# EAGLE schematic Arduino-DUE-V03-Rocket (EAGLE 8.6.0)
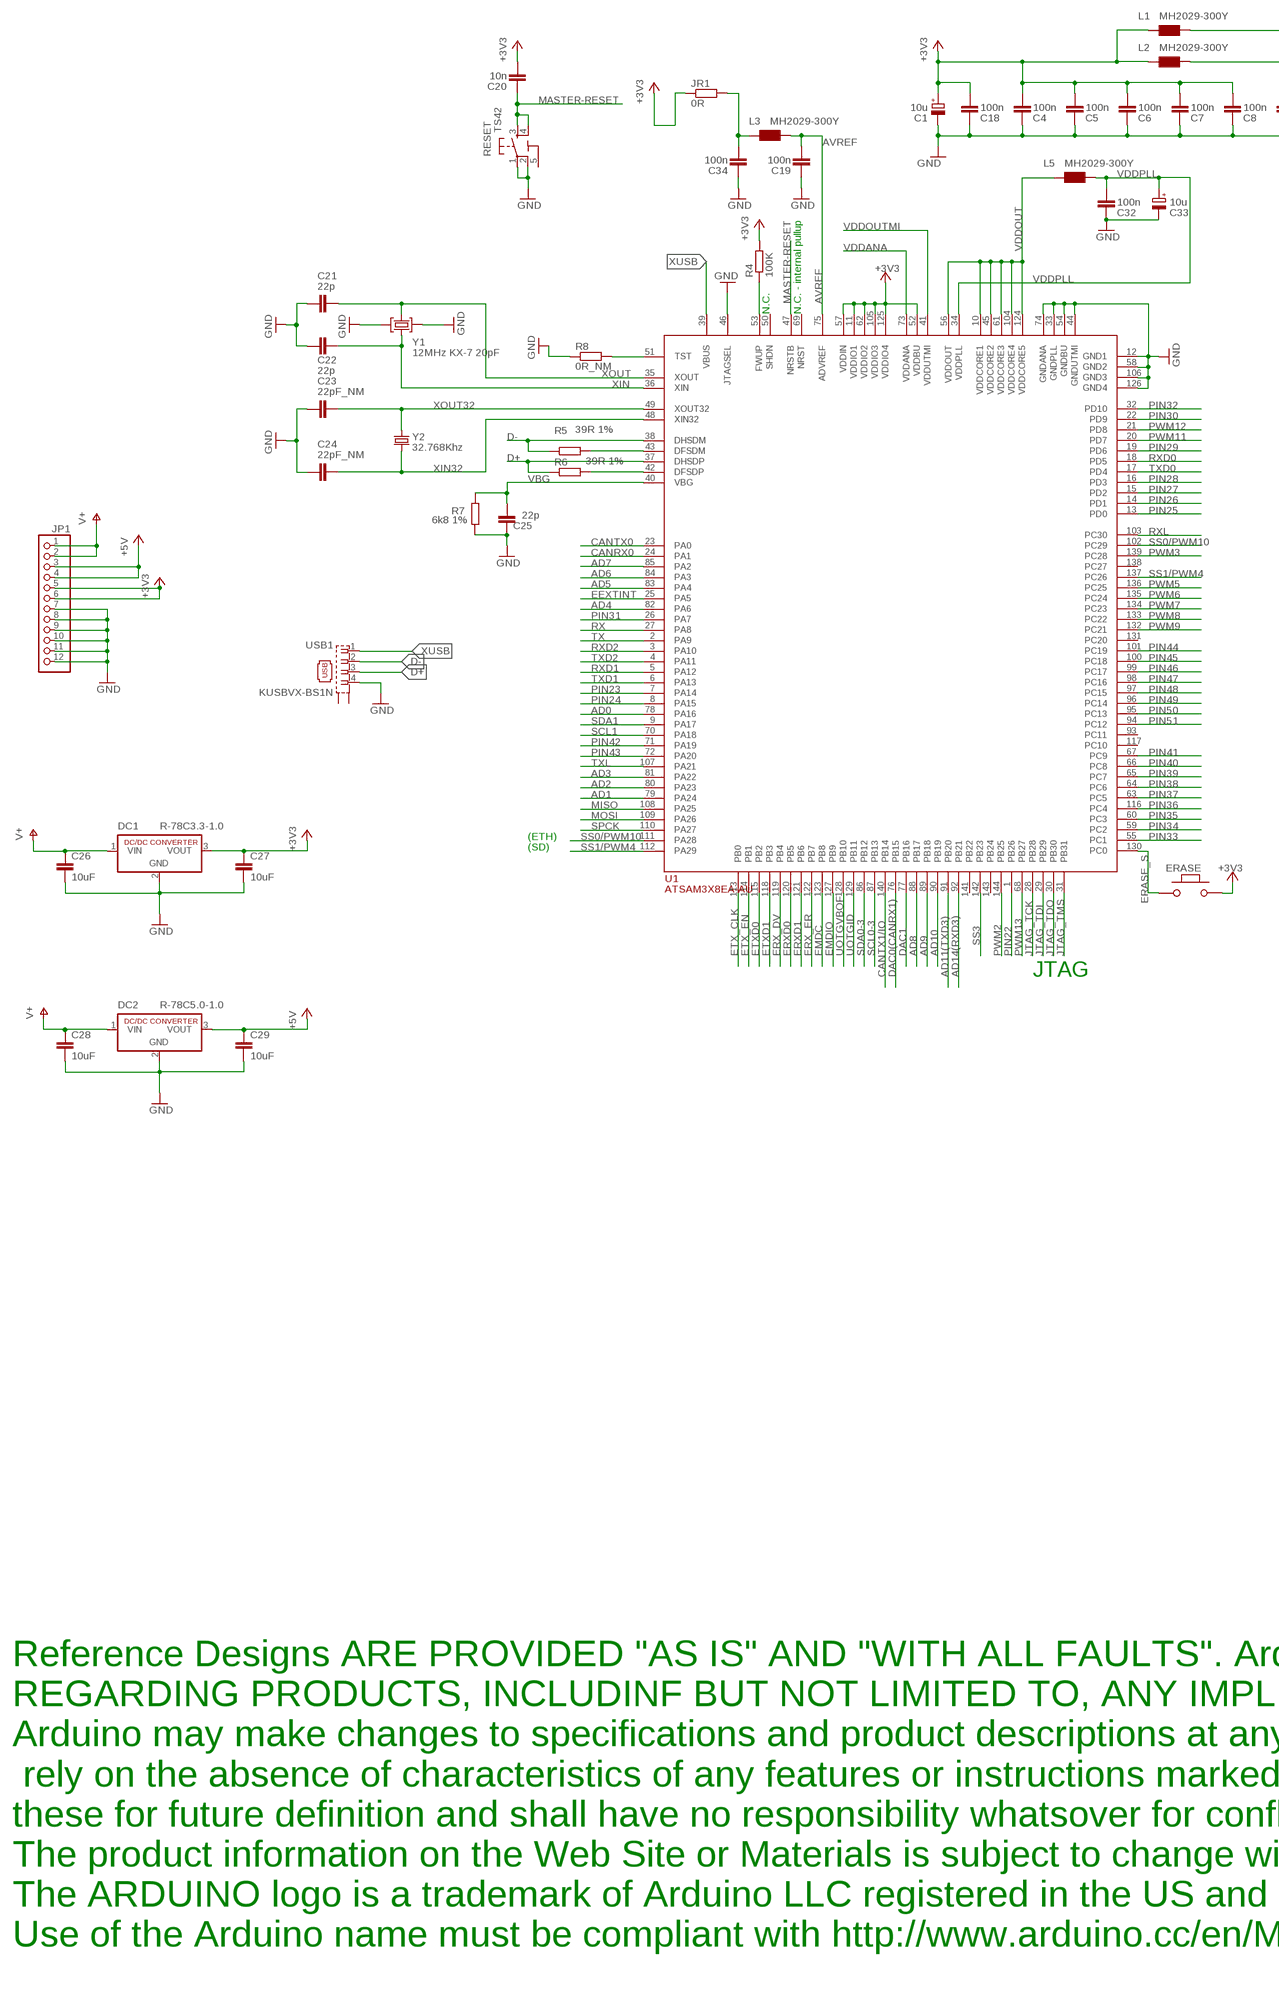
[diagram p0: schematic, sheet 1, part 1 of 2]
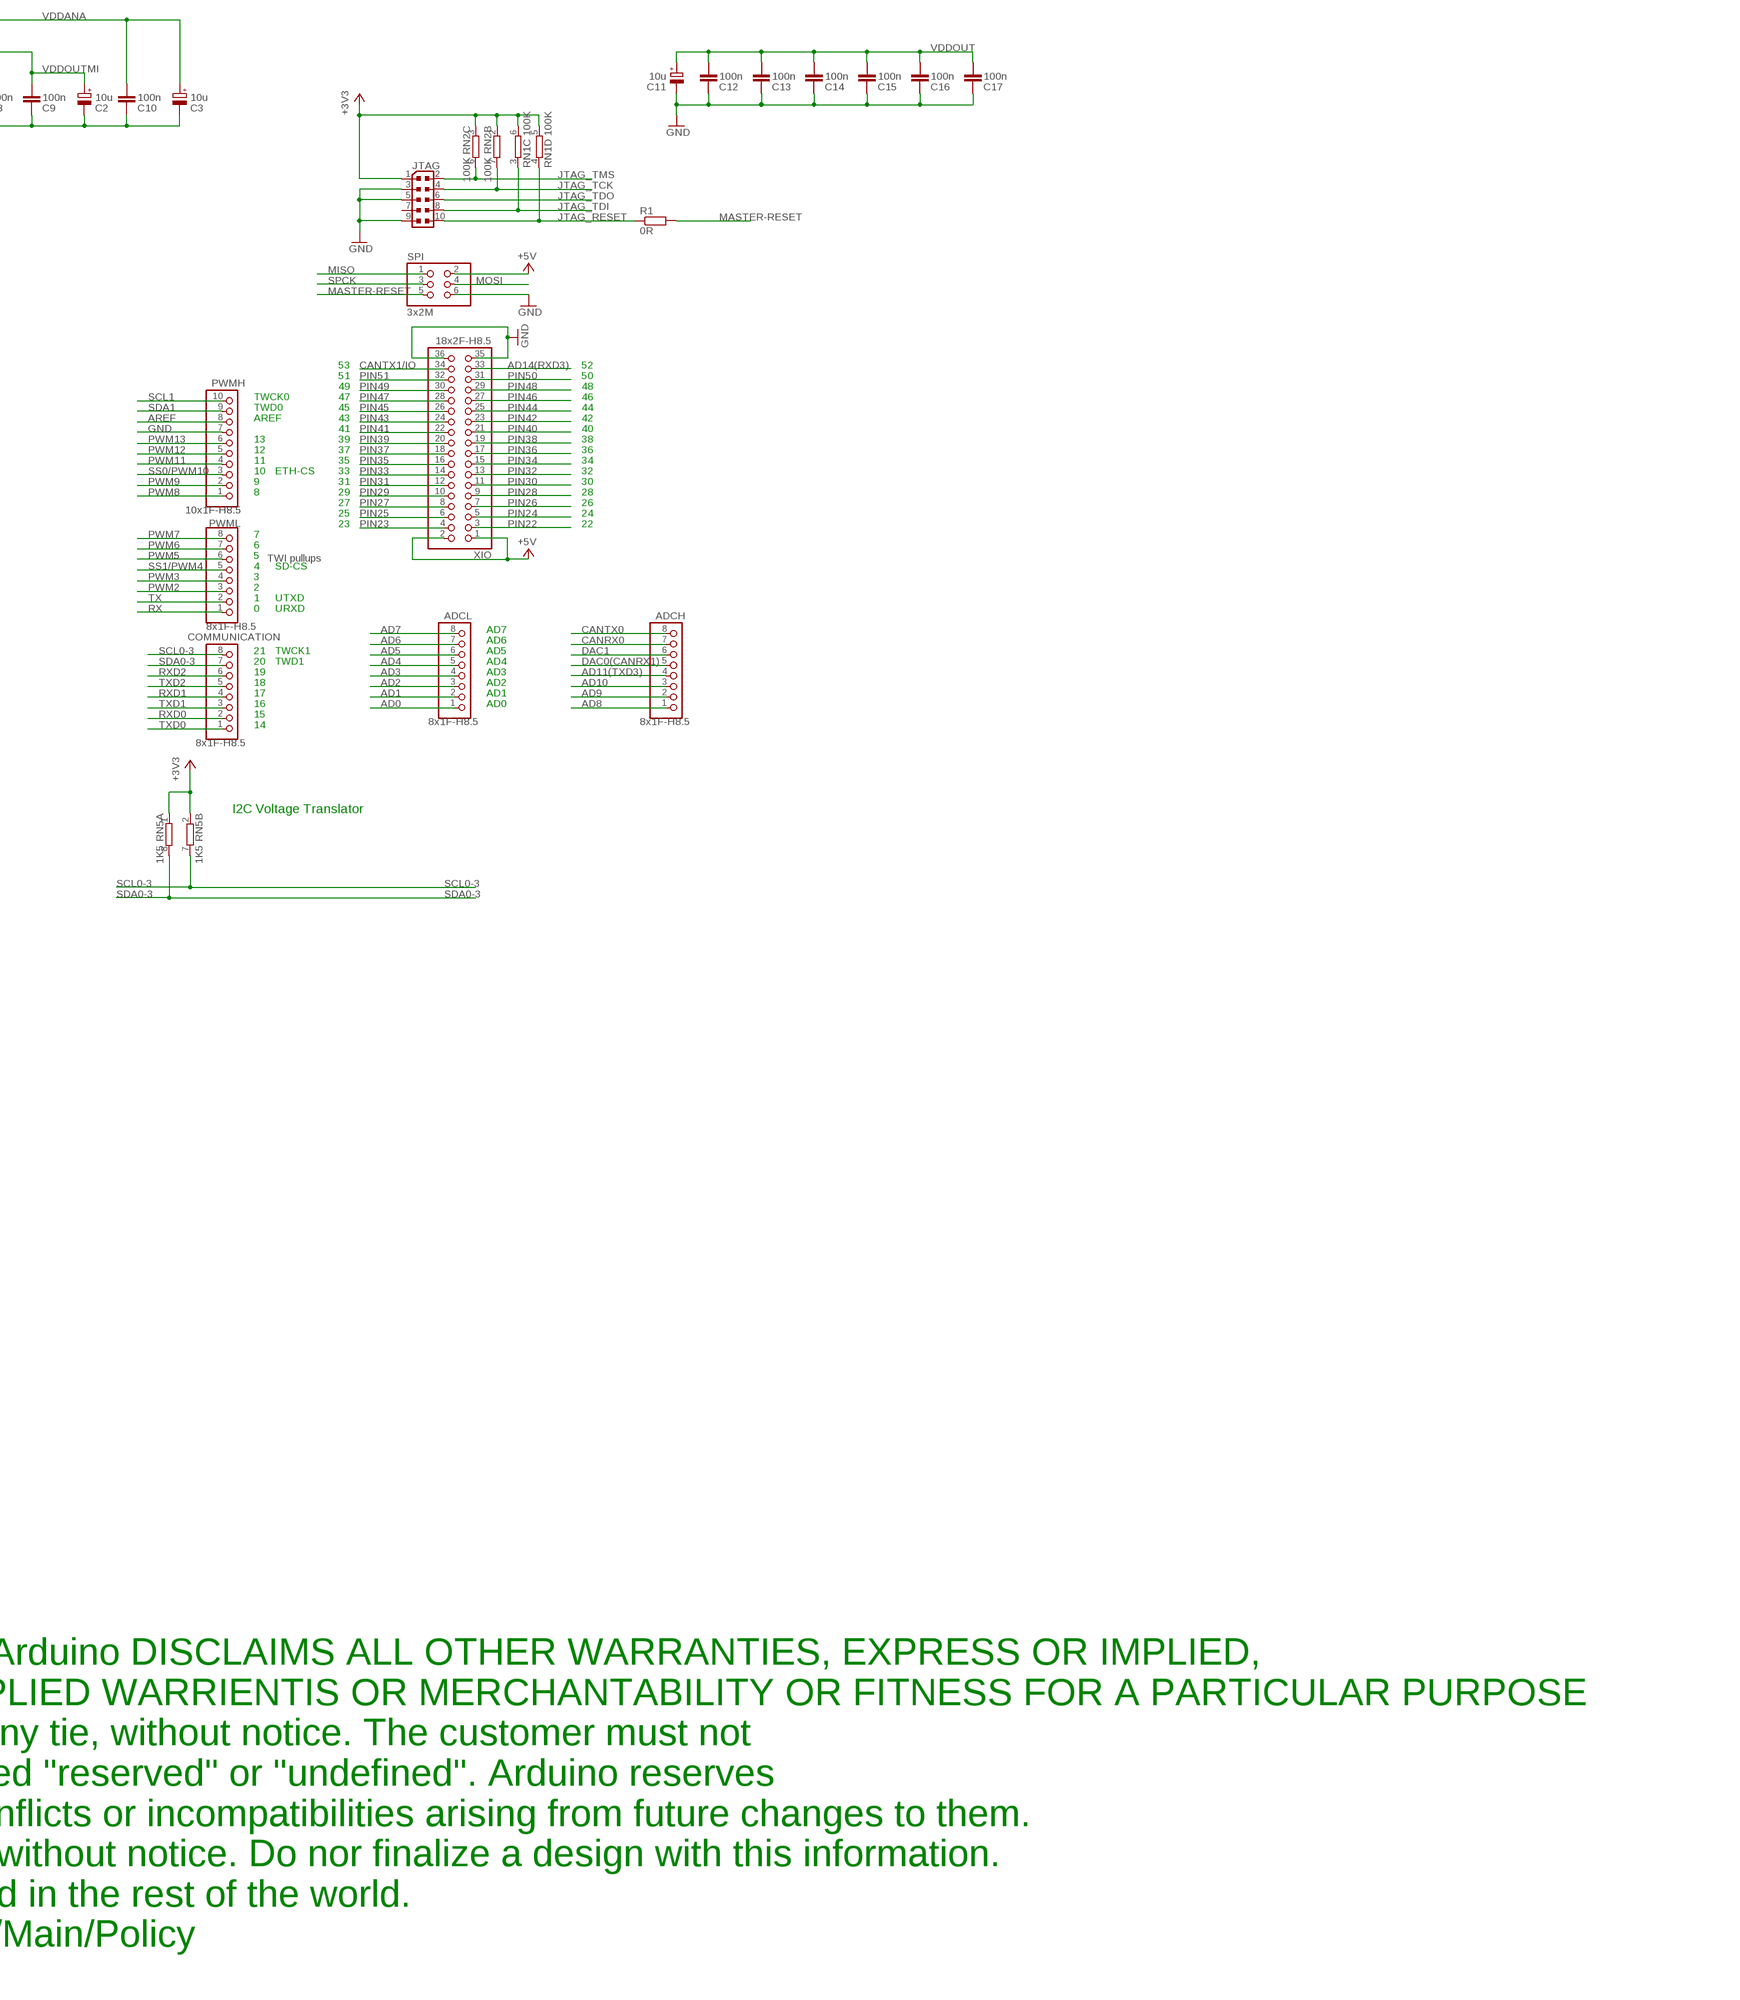
[diagram p1: schematic, sheet 1, part 2 of 2]

## Parts
ADCH  8x1F-H8.5  PINHD-1X8  [1X08]
ADCL  8x1F-H8.5  PINHD-1X8  [1X08]
C1  10u  CPOL-EUSMCB  [SMC_B]
C2  10u  CPOL-EUSMCB  [SMC_B]
C3  10u  CPOL-EUSMCB  [SMC_B]
C4  100n  C-EUC0402  [C0402]
C5  100n  C-EUC0402  [C0402]
C6  100n  C-EUC0402  [C0402]
C7  100n  C-EUC0402  [C0402]
C8  100n  C-EUC0402  [C0402]
C9  100n  C-EUC0402  [C0402]
C10  100n  C-EUC0402  [C0402]
C11  10u  CPOL-EUSMCB  [SMC_B]
C12  100n  C-EUC0402  [C0402]
C13  100n  C-EUC0402  [C0402]
C14  100n  C-EUC0402  [C0402]
C15  100n  C-EUC0402  [C0402]
C16  100n  C-EUC0402  [C0402]
C17  100n  C-EUC0402  [C0402]
C18  100n  C-EUC0402  [C0402]
C19  100n  C-EUC0402  [C0402]
C20  10n  C-EUC0402  [C0402]
C21  22p  C-EUC0402  [C0402]
C22  22p  C-EUC0402  [C0402]
C23  22pF_NM  C-EUC0402  [C0402]
C24  22pF_NM  C-EUC0402  [C0402]
C25  22p  C-EUC0402  [C0402]
C26  10uF  C-EU050-030X075  [C050-030X075]
C27  10uF  C-EU050-030X075  [C050-030X075]
C28  10uF  C-EU050-030X075  [C050-030X075]
C29  10uF  C-EU050-030X075  [C050-030X075]
C32  100n  C-EUC0402  [C0402]
C33  10u  CPOL-EUSMCB  [SMC_B]
C34  100n  C-EUC0402  [C0402]
COMMUNICATION  8x1F-H8.5  PINHD-1X8  [1X08]
DC1  R-78C3.3-1.0  [SIP3]
DC2  R-78C5.0-1.0  [SIP3]
ERASE  MYSMD_PB157  [SMD_157SW]
JP1  PINHD-1X12  [1X12]
JR1  0R  R-EU_R0402  [R0402]
JTAG  PINHEAD_PINHD-2X5PASSO127  [PINHEAD_2X05_127]
L1  MH2029-300Y  WE-CBF_0805  [0805]
L2  MH2029-300Y  WE-CBF_0805  [0805]
L3  MH2029-300Y  WE-CBF_0805  [0805]
L5  MH2029-300Y  WE-CBF_0805  [0805]
PWMH  10x1F-H8.5  PINHD-1X10  [1X10]
PWML  8x1F-H8.5  PINHD-1X8  [1X08]
R1  0R  R-EU_R0402  [R0402]
R4  100K  R-EU_R0402  [R0402]
R5  39R 1%  R-EU_R0402  [R0402]
R6  39R 1%  R-EU_R0402  [R0402]
R7  6k8 1%  R-EU_R0603  [R0603-ROUND]
R8  0R_NM  R-EU_R0402  [R0402]
RESET  TS42  [TS42]
RN1  100K  4R-NCAT16  [CAT16]
RN2  100K  4R-NCAT16  [CAT16]
RN5  1K5  4R-NCAT16  [CAT16]
SPI  3x2M  PINHD-2X3  [2X03]
U1  ATSAM3X8EA-AU  ATSAM3X/AAU  [LQFP144]
USB1  KUSBVX-BS1N  [KUSBVX-BS1N]
XIO  18x2F-H8.5  PINHD-2X18  [2X18]
Y1  12MHz KX-7 20pF  CRYSTAL-3.2-2.5  [CRYSTAL-3.2-2.5]
Y2  32.768Khz  RESONATOR_EPSON_FC_145  [RESONATOR_EPSON_FC_145]

## Nets
+3V3: C1.+ C4.2 C5.2 C6.2 C7.2 C8.2 C18.2 C20.2 C27.1 DC1.3(VOUT) ERASE.1 JP1.5 JP1.6 JR1.1 JTAG.1 L1.1 L2.1 R4.2 RN1.5 RN1.6 RN2.2 RN2.3 RN5.1 RN5.2 U1.11(VDDIO1) U1.52(VDDBU) U1.57(VDDIN) U1.62(VDDIO2) U1.105(VDDIO3) U1.125(VDDIO4)
+5V: C29.1 DC2.3(VOUT) JP1.3 JP1.4 SPI.2 XIO.1 XIO.2
AD0: ADCL.1 U1.78(PA16)
AD1: ADCL.2 U1.79(PA24)
AD2: ADCL.3 U1.80(PA23)
AD3: ADCL.4 U1.81(PA22)
AD4: ADCL.5 U1.82(PA6)
AD5: ADCL.6 U1.83(PA4)
AD6: ADCL.7 U1.84(PA3)
AD7: ADCL.8 U1.85(PA2)
AD8: ADCH.1 U1.88(PB17)
AD9: ADCH.2 U1.89(PB18)
AD10: ADCH.3 U1.90(PB19)
AD11(TXD3): ADCH.4 U1.91(PB20)
AD14(RXD3): U1.92(PB21) XIO.33
AREF: PWMH.8
AVREF: C19.2 L3.2 U1.75(ADVREF)
AVREFL: C34.2 JR1.2 L3.1
CANRX0: ADCH.7 U1.24(PA1)
CANTX0: ADCH.8 U1.23(PA0)
CANTX1/IO: U1.140(PB14) XIO.34
D+ [USBpair]: R6.1 U1.37(DHSDP) USB1.3
D- [USBpair]: R5.1 U1.38(DHSDM) USB1.2
DAC0(CANRX1): ADCH.5 U1.76(PB15)
DAC1: ADCH.6 U1.77(PB16)
EEXTINT: U1.25(PA5)
EMDC: U1.123(PB8)
EMDIO: U1.127(PB9)
ERASE_S: ERASE.2 U1.130(PC0)
ERX_DV: U1.119(PB4)
ERX_ER: U1.122(PB7)
ERXD0: U1.120(PB5)
ERXD1: U1.121(PB6)
ETX_CLK: U1.113(PB0)
ETX_EN: U1.114(PB1)
ETXD0: U1.115(PB2)
ETXD1: U1.118(PB3)
GND: C1.- C2.- C3.- C4.1 C5.1 C6.1 C7.1 C8.1 C9.1 C10.1 C11.- C12.1 C13.1 C14.1 C15.1 C16.1 C17.1 C18.1 C19.1 C21.2 C22.2 C23.2 C24.2 C25.2 C26.2 C27.2 C28.2 C29.2 C32.1 C33.- C34.1 DC1.2(GND) DC2.2(GND) JP1.7 JP1.8 JP1.9 JP1.10 JP1.11 JP1.12 JTAG.3 JTAG.5 JTAG.9 PWMH.7 R7.1 R8.1 RESET.1 RESET.2 SPI.6 U1.12(GND1) U1.33(GNDPLL) U1.44(GNDUTMI) U1.46(JTAGSEL) U1.54(GNDBU) U1.58(GND2) U1.74(GNDANA) U1.106(GND3) U1.126(GND4) USB1.4 XIO.35 XIO.36 Y1.2(GND) Y1.4(GND)
JTAG_RESET: JTAG.10 R1.1 RN1.4
JTAG_TCK: JTAG.4 RN2.7 U1.28(PB28)
JTAG_TDI: JTAG.8 RN1.3 U1.29(PB29)
JTAG_TDO: JTAG.6 U1.30(PB30)
JTAG_TMS: JTAG.2 RN2.6 U1.31(PB31)
MASTER-RESET: C20.1 R1.2 RESET.3 RESET.4 SPI.5 U1.47(NRSTB)
MISO: SPI.1 U1.108(PA25)
MOSI: SPI.4 U1.109(PA26)
N$5: R8.2 U1.51(TST)
N$7: R4.1 U1.53(FWUP)
N$11: R5.2 U1.43(DFSDM)
N$12: R6.2 U1.42(DFSDP)
PIN22: U1.1(PB26) XIO.3
PIN23: U1.7(PA14) XIO.4
PIN24: U1.8(PA15) XIO.5
PIN25: U1.13(PD0) XIO.6
PIN26: U1.14(PD1) XIO.7
PIN27: U1.15(PD2) XIO.8
PIN28: U1.16(PD3) XIO.9
PIN29: U1.19(PD6) XIO.10
PIN30: U1.22(PD9) XIO.11
PIN31: U1.26(PA7) XIO.12
PIN32: U1.32(PD10) XIO.13
PIN33: U1.55(PC1) XIO.14
PIN34: U1.59(PC2) XIO.15
PIN35: U1.60(PC3) XIO.16
PIN36: U1.116(PC4) XIO.17
PIN37: U1.63(PC5) XIO.18
PIN38: U1.64(PC6) XIO.19
PIN39: U1.65(PC7) XIO.20
PIN40: U1.66(PC8) XIO.21
PIN41: U1.67(PC9) XIO.22
PIN42: U1.71(PA19) XIO.23
PIN43: U1.72(PA20) XIO.24
PIN44: U1.101(PC19) XIO.25
PIN45: U1.100(PC18) XIO.26
PIN46: U1.99(PC17) XIO.27
PIN47: U1.98(PC16) XIO.28
PIN48: U1.97(PC15) XIO.29
PIN49: U1.96(PC14) XIO.30
PIN50: U1.95(PC13) XIO.31
PIN51: U1.94(PC12) XIO.32
PWM2: PWML.3 U1.144(PB25)
PWM3: PWML.4 U1.139(PC28)
PWM5: PWML.6 U1.136(PC25)
PWM6: PWML.7 U1.135(PC24)
PWM7: PWML.8 U1.134(PC23)
PWM8: PWMH.1 U1.133(PC22)
PWM9: PWMH.2 U1.132(PC21)
PWM11: PWMH.4 U1.20(PD7)
PWM12: PWMH.5 U1.21(PD8)
PWM13: PWMH.6 U1.68(PB27)
RX: PWML.1 U1.27(PA8)
RXD0: COMMUNICATION.2 U1.18(PD5)
RXD1: COMMUNICATION.4 U1.5(PA12)
RXD2: COMMUNICATION.6 U1.3(PA10)
RXL: U1.103(PC30)
SCL0-3: COMMUNICATION.8 RN5.7 U1.87(PB13)
SCL1: PWMH.10 U1.70(PA18)
SDA0-3: COMMUNICATION.7 RN5.8 U1.86(PB12)
SDA1: PWMH.9 U1.9(PA17)
SPCK: SPI.3 U1.110(PA27)
SS0/PWM10: PWMH.3 U1.102(PC29) U1.111(PA28)
SS1/PWM4: PWML.5 U1.112(PA29) U1.137(PC26)
SS3: U1.142(PB23)
TX: PWML.2 U1.2(PA9)
TXD0: COMMUNICATION.1 U1.17(PD4)
TXD1: COMMUNICATION.3 U1.6(PA13)
TXD2: COMMUNICATION.5 U1.4(PA11)
TXL: U1.107(PA21)
UOTGID: U1.129(PB11)
UOTGVBOF: U1.128(PB10)
V+: C26.1 C28.1 DC1.1(VIN) DC2.1(VIN) JP1.1 JP1.2
VBG: C25.1 R7.2 U1.40(VBG)
VDDANA: C3.+ C10.2 L1.2 U1.73(VDDANA)
VDDOUT: C11.+ C12.2 C13.2 C14.2 C15.2 C16.2 C17.2 L5.1 U1.10(VDDCORE1) U1.45(VDDCORE2) U1.56(VDDOUT) U1.61(VDDCORE3) U1.104(VDDCORE4) U1.124(VDDCORE5)
VDDOUTMI: C2.+ C9.2 L2.2 U1.41(VDDUTMI)
VDDPLL: C32.2 C33.+ L5.2 U1.34(VDDPLL)
XIN: C22.1 U1.36(XIN) Y1.1(C1)
XIN32: C24.1 U1.48(XIN32) Y2.P$2
XOUT: C21.1 U1.35(XOUT) Y1.3(C2)
XOUT32: C23.1 U1.49(XOUT32) Y2.P$1
XUSB [usbvcc]: U1.39(VBUS) USB1.1
Unconnected: JTAG.7 RN1.1 RN1.2 RN1.7 RN1.8 RN2.1 RN2.4 RN2.5 RN2.8 RN5.3 RN5.4 RN5.5 RN5.6 U1.50(SHDN) U1.69(NRST) U1.93(PC11) U1.117(PC10) U1.131(PC20) U1.138(PC27) U1.141(PB22) U1.143(PB24) USB1.M1(S1) USB1.M2(S2)

## Notes on the sheet
- N.C. | N.C. - internal pullup
- 53 | 52
- 51 | 50
- 49 | 48
- TWCK0 | 47 | 46
- TWD0 | 45 | 44
- AREF | 43 | 42
- 41 | 40
- 13 | 39 | 38
- 12 | 37 | 36
- 11 | 35 | 34
- 10 | ETH-CS | 33 | 32
- 9 | 31 | 30
- 8 | 29 | 28
- 27 | 26
- 25 | 24
- 23 | 22
- 7
- 6
- 5 | TWI pullups
- 4 | SD-CS
- 3
- 2
- 1 | UTXD
- 0 | URXD
- AD7
- AD6
- 21 | TWCK1 | AD5
- 20 | TWD1 | AD4
- 19 | AD3
- 18 | AD2
- 17 | AD1
- 16 | AD0
- 15
- 14
- I2C Voltage Translator
- (ETH)
- (SD)
- JTAG
- Reference Designs ARE PROVIDED "AS IS" AND "WITH ALL FAULTS". Arduino DISCLAIMS ALL OTHER WARRANTIES, EXPRESS OR IMPLIED,
  REGARDING PRODUCTS, INCLUDINF BUT NOT LIMITED TO, ANY IMPLIED WARRIENTIS OR MERCHANTABILITY OR FITNESS FOR A PARTICULAR PURPOSE
  Arduino may make changes to specifications and product descriptions at any tie, without notice. The customer must not
   rely on the absence of characteristics of any features or instructions marked "reserved" or "undefined". Arduino reserves
  these for future definition and shall have no responsibility whatsover for conflicts or incompatibilities arising from future changes to them.
  The product information on the Web Site or Materials is subject to change without notice. Do nor finalize a design with this information.
  The ARDUINO logo is a trademark of Arduino LLC registered in the US and in the rest of the world.
  Use of the Arduino name must be compliant with http://www.arduino.cc/en/Main/Policy

## Power pins joined to a net without a drawn wire
5-GND: RESET.5(5-GND)

## Library data of the parts
ADCH ADCL COMMUNICATION PWML = SmartPrj:PINHD-1X8: PIN HEADER
C1-C3 C11 C33 = rcl:CPOL-EU: POLARIZED CAPACITOR, European symbol
C4-C10 C12-C25 C32 C34 = SmartPrj:C-EU: CAPACITOR, European symbol
C26-C29 = resistor:C-EU: CAPACITOR, European symbol
DC1 DC2 = dc-dc-converter:R-78C*-1.0: INNOLINE DC/DC-Converter 1.0 AMP SIP3 Single Output Source: Data sheet <http://www.mikrocontroller.net/attachment/150645/157764-da-01-en-DC_DC_WANDLER_R_78C5_0_1_0.pdf>
ERASE = SmartPrj:MYSMD_PB157
JP1 = pinhead:PINHD-1X12: PIN HEADER
JR1 R1 R4-R8 = SmartPrj:R-EU_: RESISTOR, European symbol
JTAG = Arduino_Wifi_shield_v018_tG:PINHEAD_PINHD-2X5: PIN HEADER
L1-L3 L5 = wuerth-elektronik:WE-CBF: SMD EMI Suppression Ferrite Beads - excellent anti-EMI properties - low DCR - impedances till 3000 ohms - rated current up to 6 A
PWMH = SmartPrj:PINHD-1X10: PIN HEADER
RESET = SmartPrj:TS42: TS42 Dongnan Electronics Tact switch VDC 12V - 50mA
RN1 RN2 RN5 = resistor-dil:4R-N: Array Chip Resistor Source: RS Component / Phycomp
SPI = SmartPrj:PINHD-2X3: PIN HEADER
U1 = SmartPrj:ATSAM3X/A
USB1 = con-kycon:KUSBVX-BS1N: USB B-type Receptacle Vertical, 4 Position, Through Hole Source: Sibalco Kycon KUSBVX-BS1N-xxx.pdf
XIO = SmartPrj:PINHD-2X18: PIN HEADER
Y1 = SmartPrj:CRYSTAL-3.2-2.5
Y2 = Arduino_Wifi_shield_v018_tG:RESONATOR_EPSON_FC_145

## Net classes
0 default: width 0.203 mm, drill 0.406 mm, clearance 0.203 mm
1 USB: width 0.203 mm, drill 0.406 mm, clearance 0.203 mm
2 gnd: width 0.203 mm, drill 0.406 mm, clearance 0.203 mm
3 usbvcc: width 0.203 mm, drill 0.406 mm, clearance 0.203 mm
4 USBpair: width 0.254 mm, drill 0.406 mm, clearance 0.61 mm